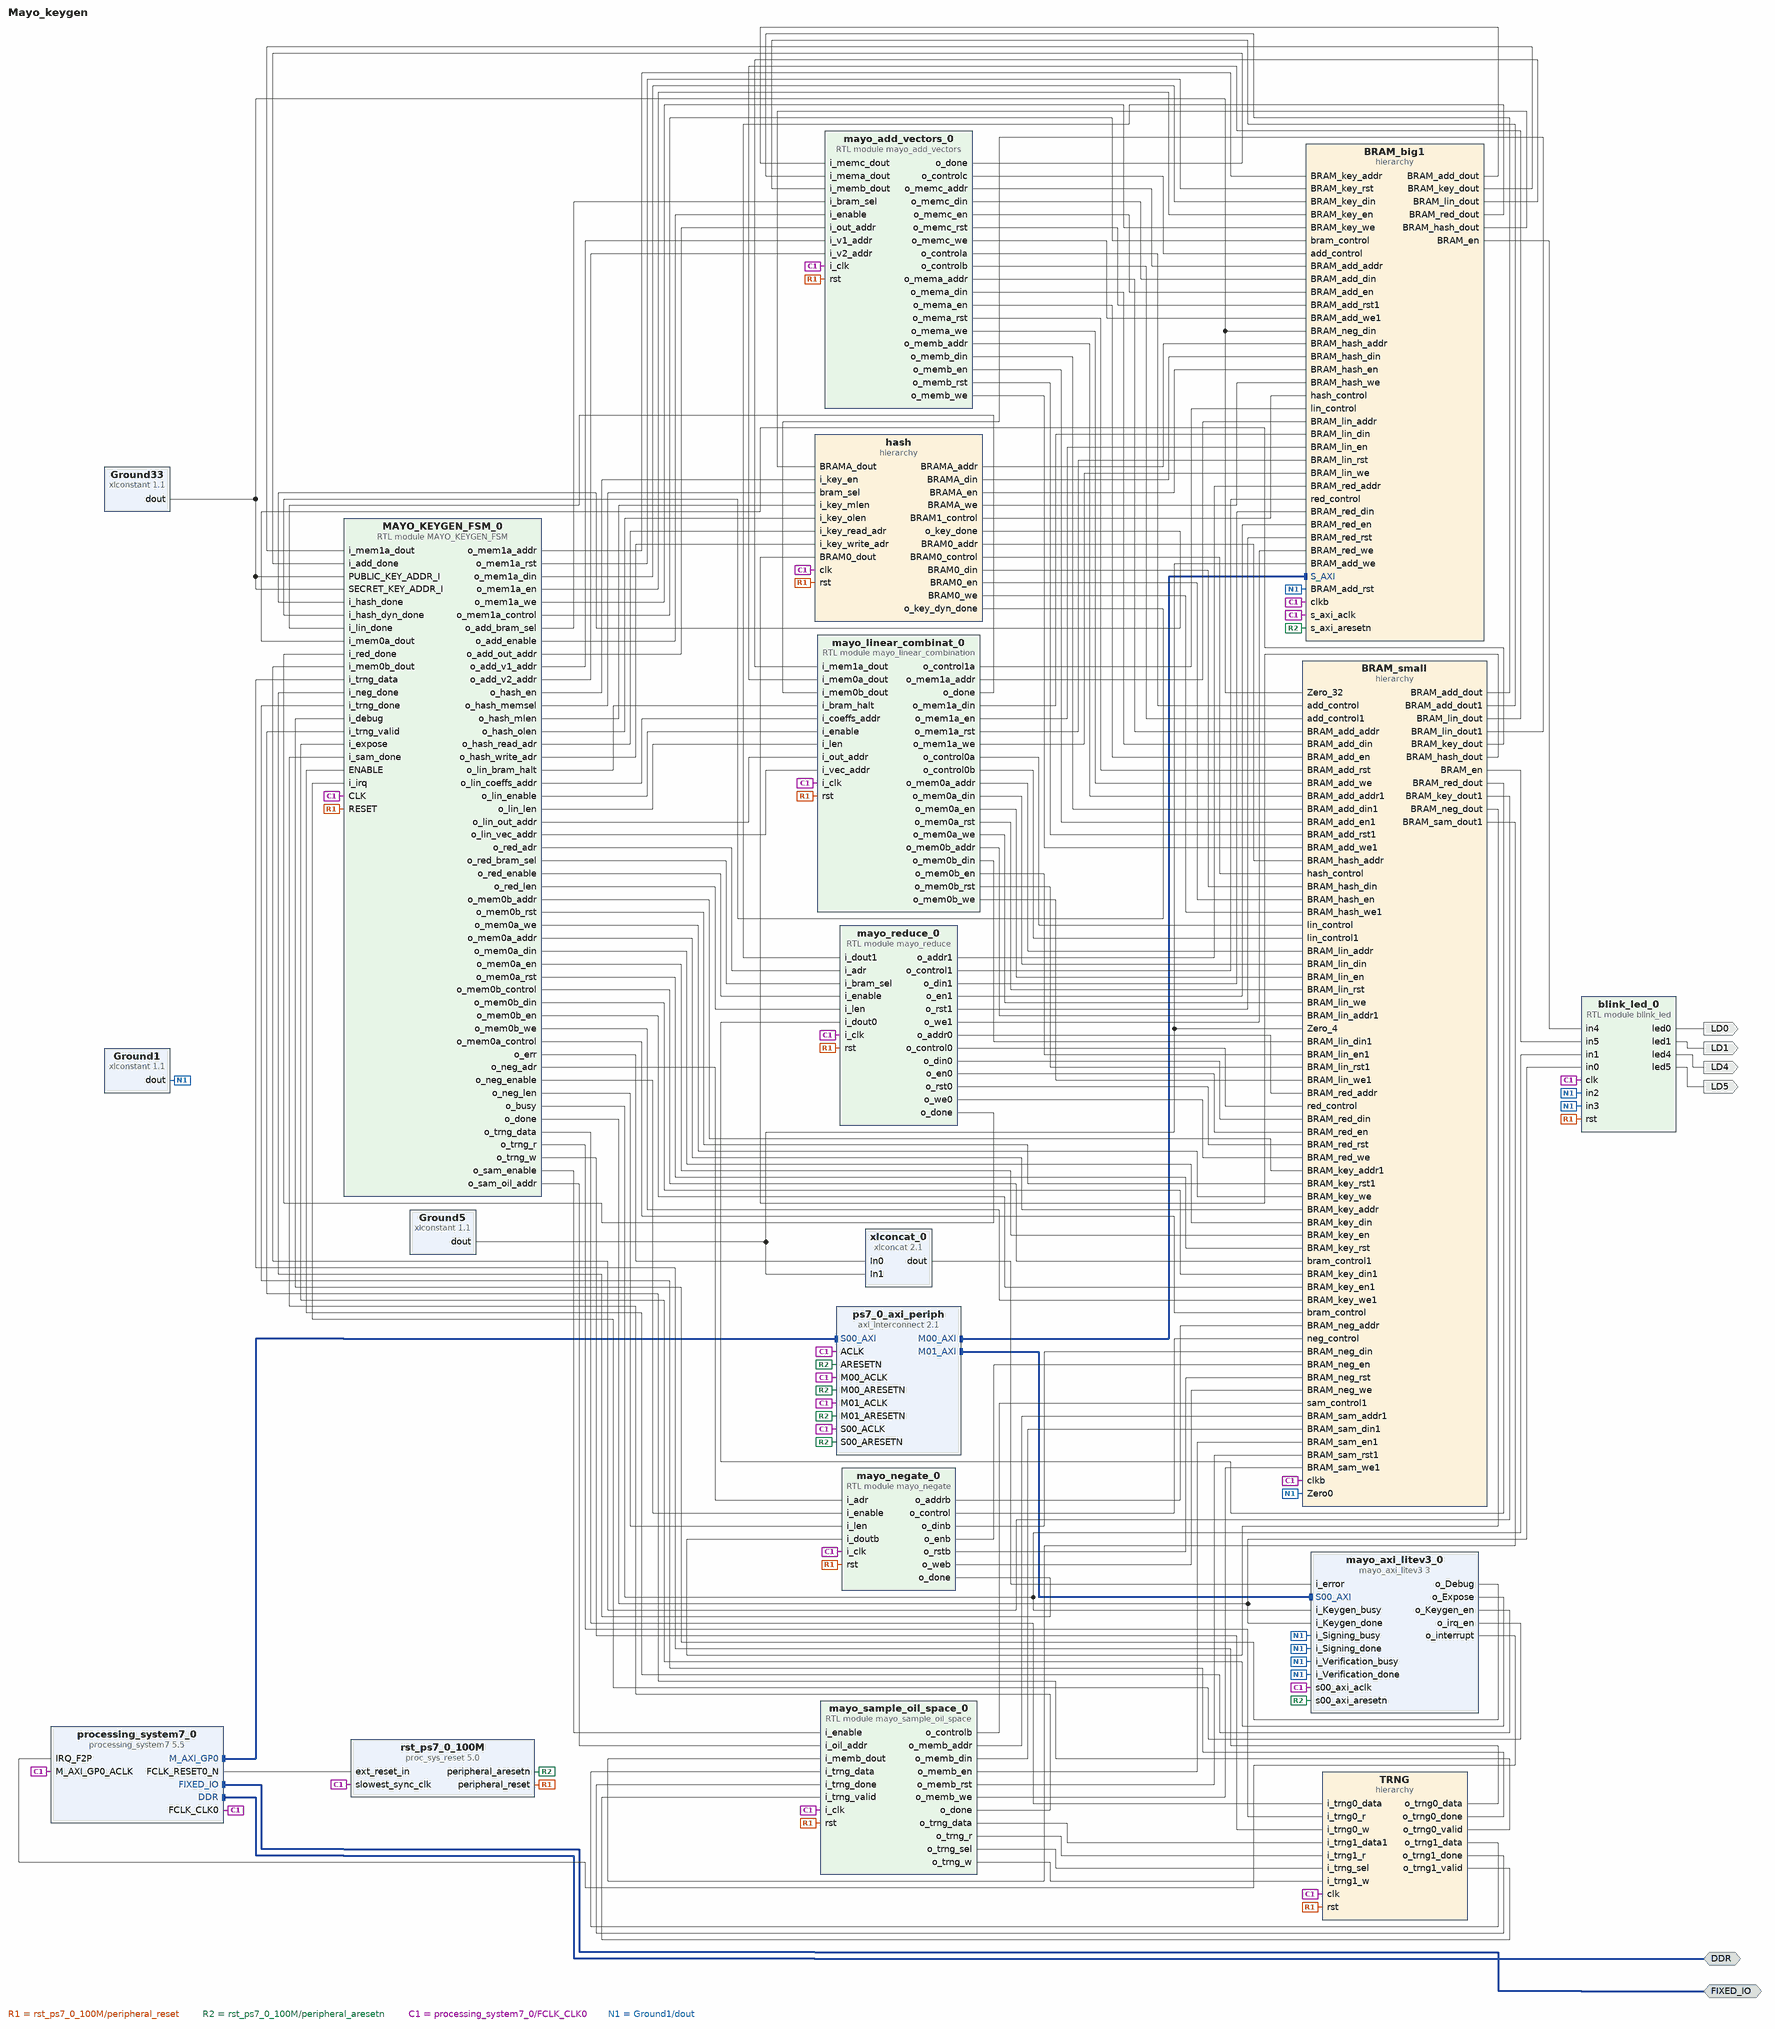
[diagram p0: block diagram of the top level]
# Vivado block design Mayo_keygen, xc7z020clg484-1, Vivado 2020.2
create_bd_design Mayo_keygen

create_bd_intf_port -mode Master -vlnv xilinx.com:interface:ddrx_rtl:1.0 DDR
create_bd_intf_port -mode Master -vlnv xilinx.com:display_processing_system7:fixedio_rtl:1.0 FIXED_IO
create_bd_port -dir O LD0
create_bd_port -dir O LD1
create_bd_port -dir O LD5
create_bd_port -dir O LD4

create_bd_cell -type ip -vlnv xilinx.com:ip:processing_system7:5.5 processing_system7_0
set_property -dict [list \
  CONFIG.PCW_APU_PERIPHERAL_FREQMHZ 666.666667 \
  CONFIG.PCW_ENET0_ENET0_IO {MIO 16 .. 27} \
  CONFIG.PCW_ENET0_GRP_MDIO_ENABLE 1 \
  CONFIG.PCW_ENET0_GRP_MDIO_IO {MIO 52 .. 53} \
  CONFIG.PCW_ENET0_PERIPHERAL_ENABLE 1 \
  CONFIG.PCW_ENET0_RESET_ENABLE 0 \
  CONFIG.PCW_ENET_RESET_ENABLE 1 \
  CONFIG.PCW_ENET_RESET_SELECT {Share reset pin} \
  CONFIG.PCW_FPGA0_PERIPHERAL_FREQMHZ 100 \
  CONFIG.PCW_FPGA1_PERIPHERAL_FREQMHZ 150.000000 \
  CONFIG.PCW_GPIO_MIO_GPIO_ENABLE 1 \
  CONFIG.PCW_GPIO_MIO_GPIO_IO MIO \
  CONFIG.PCW_I2C_RESET_ENABLE 1 \
  CONFIG.PCW_IRQ_F2P_INTR 1 \
  CONFIG.PCW_PRESET_BANK1_VOLTAGE {LVCMOS 1.8V} \
  CONFIG.PCW_QSPI_GRP_SINGLE_SS_ENABLE 1 \
  CONFIG.PCW_QSPI_GRP_SINGLE_SS_IO {MIO 1 .. 6} \
  CONFIG.PCW_QSPI_PERIPHERAL_ENABLE 1 \
  CONFIG.PCW_QSPI_QSPI_IO {MIO 1 .. 6} \
  CONFIG.PCW_SD0_GRP_CD_ENABLE 1 \
  CONFIG.PCW_SD0_GRP_CD_IO {MIO 47} \
  CONFIG.PCW_SD0_GRP_WP_ENABLE 1 \
  CONFIG.PCW_SD0_GRP_WP_IO {MIO 46} \
  CONFIG.PCW_SD0_PERIPHERAL_ENABLE 1 \
  CONFIG.PCW_SD0_SD0_IO {MIO 40 .. 45} \
  CONFIG.PCW_SDIO_PERIPHERAL_FREQMHZ 50 \
  CONFIG.PCW_SINGLE_QSPI_DATA_MODE x4 \
  CONFIG.PCW_TTC0_PERIPHERAL_ENABLE 1 \
  CONFIG.PCW_TTC0_TTC0_IO EMIO \
  CONFIG.PCW_UART1_PERIPHERAL_ENABLE 1 \
  CONFIG.PCW_UART1_UART1_IO {MIO 48 .. 49} \
  CONFIG.PCW_UART_PERIPHERAL_FREQMHZ 50 \
  CONFIG.PCW_UIPARAM_DDR_FREQ_MHZ 533.333313 \
  CONFIG.PCW_UIPARAM_DDR_PARTNO {MT41J128M16 HA-15E} \
  CONFIG.PCW_USB0_PERIPHERAL_ENABLE 1 \
  CONFIG.PCW_USB0_RESET_ENABLE 0 \
  CONFIG.PCW_USB0_USB0_IO {MIO 28 .. 39} \
  CONFIG.PCW_USB_RESET_ENABLE 1 \
  CONFIG.PCW_USB_RESET_SELECT {Share reset pin} \
  CONFIG.PCW_USE_FABRIC_INTERRUPT 1 \
  CONFIG.preset ZedBoard \
] [get_bd_cells processing_system7_0]
# 223 more settings of processing_system7_0 are not shown: defaults, MIO pin electricals, DDR timing, and values the tool derives
create_bd_cell -type ip -vlnv xilinx.com:ip:axi_interconnect:2.1 ps7_0_axi_periph
set_property -dict {CONFIG.NUM_MI 2} [get_bd_cells ps7_0_axi_periph]
create_bd_cell -type ip -vlnv xilinx.com:ip:proc_sys_reset:5.0 rst_ps7_0_100M
create_bd_cell -type hier BRAM_big1
create_bd_cell -type hier BRAM_small
create_bd_cell -type ip -vlnv xilinx.com:ip:xlconstant:1.1 Ground1
set_property -dict {CONFIG.CONST_VAL 0} [get_bd_cells Ground1]
create_bd_cell -type ip -vlnv xilinx.com:ip:xlconstant:1.1 Ground33
set_property -dict {CONFIG.CONST_VAL 0x00000000 CONFIG.CONST_WIDTH 32} [get_bd_cells Ground33]
create_bd_cell -type ip -vlnv xilinx.com:ip:xlconstant:1.1 Ground5
set_property -dict {CONFIG.CONST_VAL 0000 CONFIG.CONST_WIDTH 4} [get_bd_cells Ground5]
create_bd_cell -type hier TRNG
create_bd_cell -type hier hash
create_bd_cell -type ip -vlnv xilinx.com:ip:xlconcat:2.1 xlconcat_0
set_property -dict {CONFIG.NUM_PORTS 4} [get_bd_cells xlconcat_0]
create_bd_cell -type ip -vlnv user.org:user:mayo_axi_litev3:3 mayo_axi_litev3_0
create_bd_cell -type module -reference blink_led blink_led_0
create_bd_cell -type module -reference MAYO_KEYGEN_FSM MAYO_KEYGEN_FSM_0
create_bd_cell -type module -reference mayo_negate mayo_negate_0
set_property -dict {CONFIG.BRAM_SIZE 32} [get_bd_cells mayo_negate_0]
create_bd_cell -type module -reference mayo_reduce mayo_reduce_0
create_bd_cell -type module -reference mayo_sample_oil_space mayo_sample_oil_space_0
create_bd_cell -type module -reference mayo_linear_combination mayo_linear_combinat_0
create_bd_cell -type module -reference mayo_add_vectors mayo_add_vectors_0

# ---- hierarchy /BRAM_big1 ----
current_bd_instance /BRAM_big1
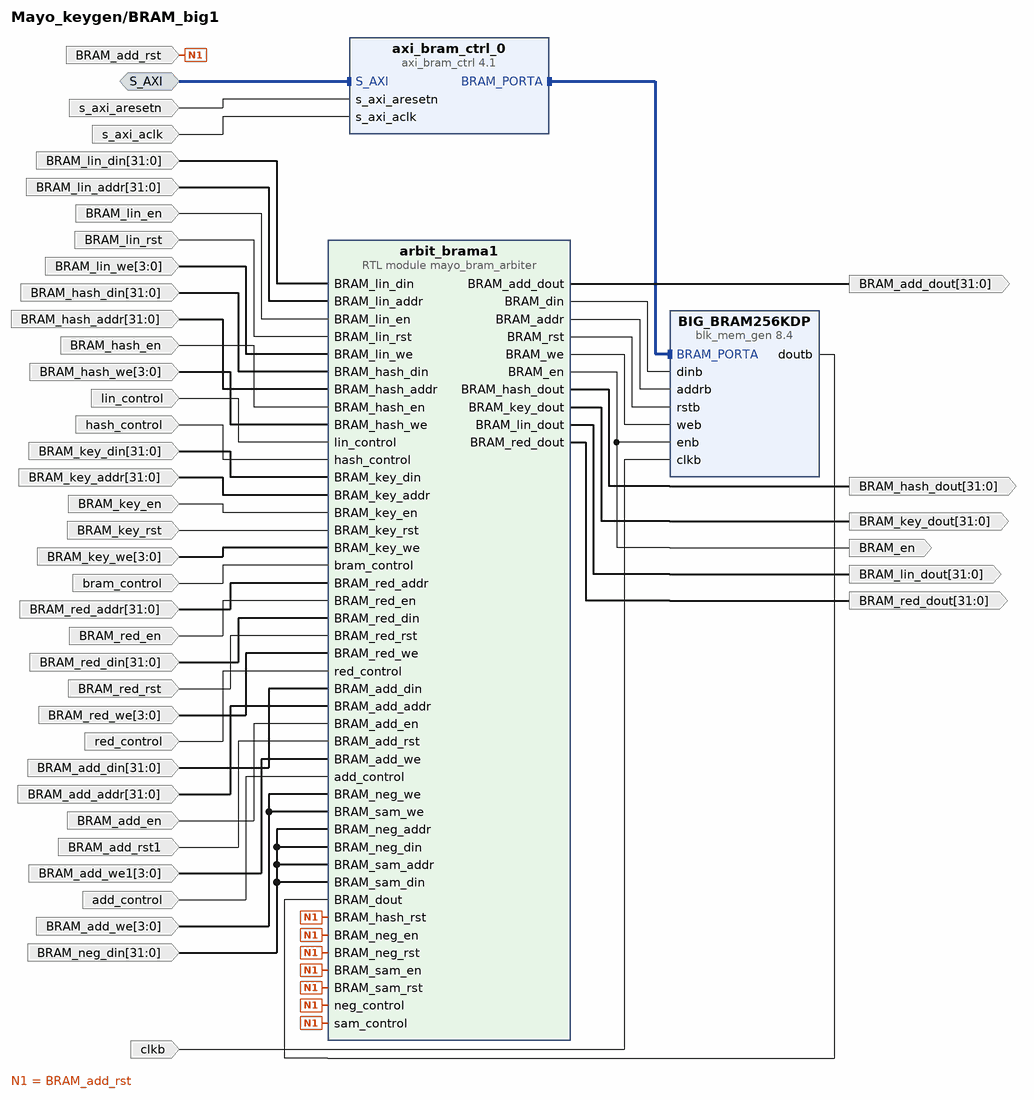
[diagram p1: block diagram inside /BRAM_big1]
create_bd_intf_pin -mode Slave -vlnv xilinx.com:interface:aximm_rtl:1.0 S_AXI
create_bd_pin -dir I -from 31 -to 0 BRAM_neg_din
create_bd_pin -dir I -type rst BRAM_add_rst
create_bd_pin -dir I -from 31 -to 0 BRAM_lin_din
create_bd_pin -dir I -from 31 -to 0 BRAM_lin_addr
create_bd_pin -dir I BRAM_lin_en
create_bd_pin -dir I -type rst BRAM_lin_rst
create_bd_pin -dir I -from 3 -to 0 BRAM_lin_we
create_bd_pin -dir O -from 31 -to 0 BRAM_lin_dout
create_bd_pin -dir O -from 31 -to 0 BRAM_key_dout
create_bd_pin -dir I -from 31 -to 0 BRAM_hash_din
create_bd_pin -dir I -from 31 -to 0 BRAM_hash_addr
create_bd_pin -dir I BRAM_hash_en
create_bd_pin -dir I -from 3 -to 0 BRAM_hash_we
create_bd_pin -dir O -from 31 -to 0 BRAM_hash_dout
create_bd_pin -dir I lin_control
create_bd_pin -dir I hash_control
create_bd_pin -dir I -from 31 -to 0 BRAM_key_din
create_bd_pin -dir I -from 31 -to 0 BRAM_key_addr
create_bd_pin -dir I BRAM_key_en
create_bd_pin -dir I -type rst BRAM_key_rst
create_bd_pin -dir I -from 3 -to 0 BRAM_key_we
create_bd_pin -dir I bram_control
create_bd_pin -dir I -from 3 -to 0 BRAM_add_we
create_bd_pin -dir I -from 31 -to 0 BRAM_red_addr
create_bd_pin -dir I BRAM_red_en
create_bd_pin -dir I -from 31 -to 0 BRAM_red_din
create_bd_pin -dir I -type rst BRAM_red_rst
create_bd_pin -dir I -from 3 -to 0 BRAM_red_we
create_bd_pin -dir I red_control
create_bd_pin -dir O -from 31 -to 0 BRAM_red_dout
create_bd_pin -dir O -from 31 -to 0 BRAM_add_dout
create_bd_pin -dir I -from 31 -to 0 BRAM_add_din
create_bd_pin -dir I -from 31 -to 0 BRAM_add_addr
create_bd_pin -dir I BRAM_add_en
create_bd_pin -dir I -type rst BRAM_add_rst1
create_bd_pin -dir I -from 3 -to 0 BRAM_add_we1
create_bd_pin -dir I add_control
create_bd_pin -dir I -type rst s_axi_aresetn
create_bd_pin -dir I -type clk s_axi_aclk
create_bd_pin -dir I -type clk clkb
create_bd_pin -dir O BRAM_en

create_bd_cell -type ip -vlnv xilinx.com:ip:axi_bram_ctrl:4.1 axi_bram_ctrl_0
set_property -dict {CONFIG.PROTOCOL AXI4 CONFIG.SINGLE_PORT_BRAM 1 CONFIG.USE_ECC 0} [get_bd_cells axi_bram_ctrl_0]
create_bd_cell -type ip -vlnv xilinx.com:ip:blk_mem_gen:8.4 BIG_BRAM256KDP
set_property -dict [list \
  CONFIG.EN_SAFETY_CKT true \
  CONFIG.Enable_32bit_Address true \
  CONFIG.Enable_B Use_ENB_Pin \
  CONFIG.Memory_Type True_Dual_Port_RAM \
  CONFIG.Port_B_Clock 100 \
  CONFIG.Port_B_Enable_Rate 100 \
  CONFIG.Port_B_Write_Rate 50 \
  CONFIG.Read_Width_A 32 \
  CONFIG.Read_Width_B 32 \
  CONFIG.Register_PortA_Output_of_Memory_Primitives false \
  CONFIG.Register_PortB_Output_of_Memory_Primitives false \
  CONFIG.Use_RSTA_Pin true \
  CONFIG.Use_RSTB_Pin true \
  CONFIG.Write_Width_A 32 \
  CONFIG.Write_Width_B 32 \
  CONFIG.use_bram_block BRAM_Controller \
] [get_bd_cells BIG_BRAM256KDP]
create_bd_cell -type module -reference mayo_bram_arbiter arbit_brama1

# ---- hierarchy /BRAM_small ----
current_bd_instance /BRAM_small
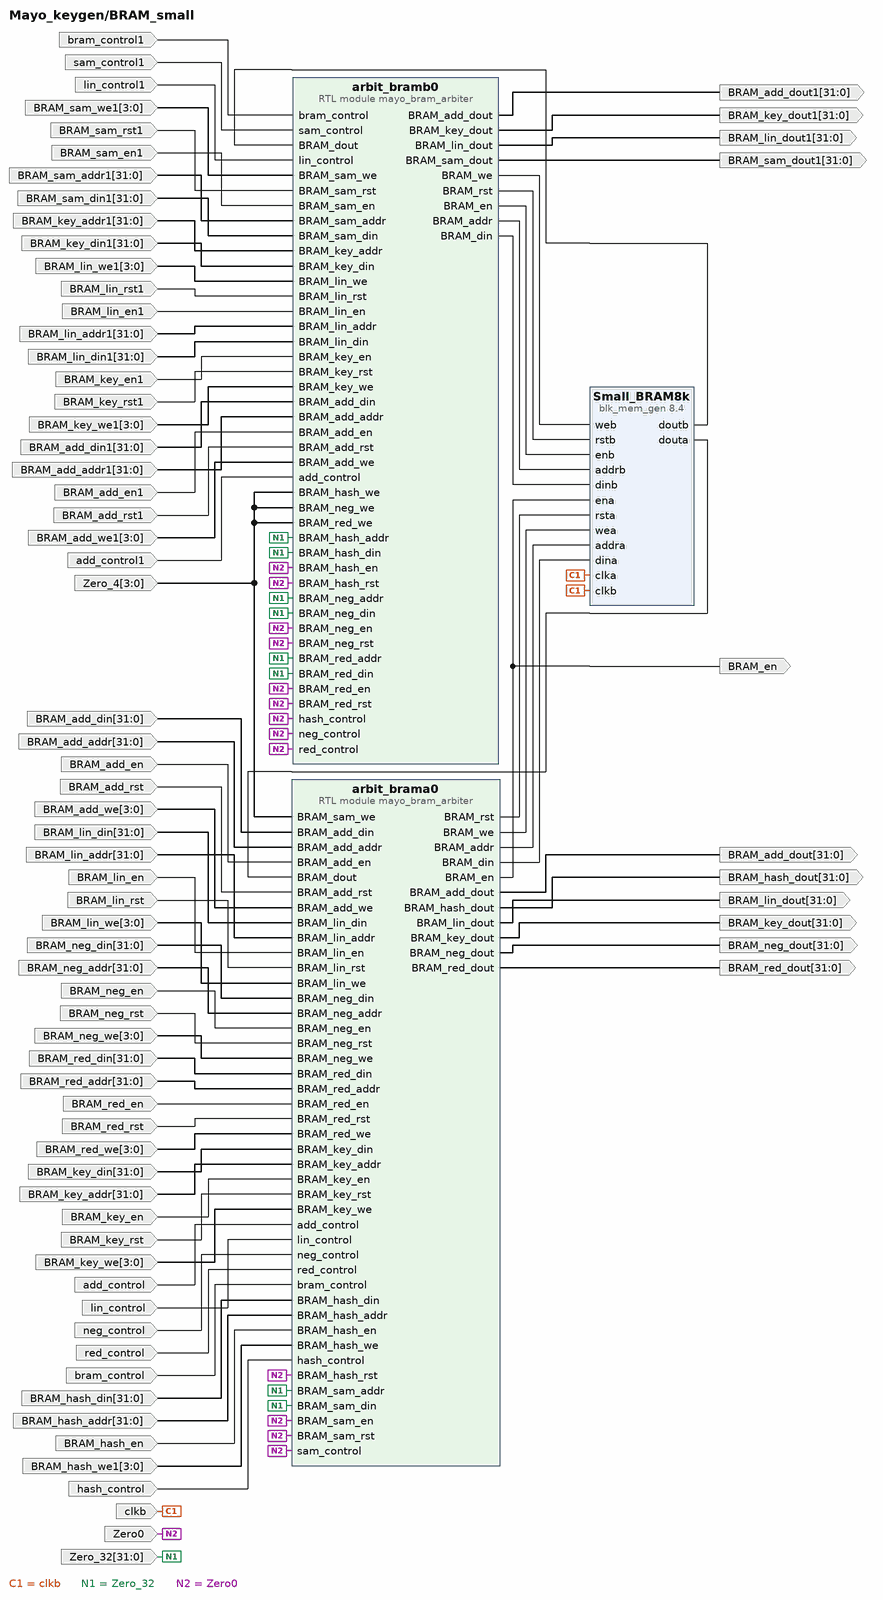
[diagram p2: block diagram inside /BRAM_small]
create_bd_pin -dir I -type clk clkb
create_bd_pin -dir I -from 31 -to 0 BRAM_add_din
create_bd_pin -dir I -from 31 -to 0 BRAM_add_addr
create_bd_pin -dir I BRAM_add_en
create_bd_pin -dir I -type rst BRAM_add_rst
create_bd_pin -dir I -from 3 -to 0 BRAM_add_we
create_bd_pin -dir O -from 31 -to 0 BRAM_add_dout
create_bd_pin -dir I -from 31 -to 0 BRAM_lin_din
create_bd_pin -dir I -from 31 -to 0 BRAM_lin_addr
create_bd_pin -dir I BRAM_lin_en
create_bd_pin -dir I -type rst BRAM_lin_rst
create_bd_pin -dir I -from 3 -to 0 BRAM_lin_we
create_bd_pin -dir O -from 31 -to 0 BRAM_lin_dout
create_bd_pin -dir I -from 31 -to 0 BRAM_neg_din
create_bd_pin -dir I -from 31 -to 0 BRAM_neg_addr
create_bd_pin -dir I BRAM_neg_en
create_bd_pin -dir I -type rst BRAM_neg_rst
create_bd_pin -dir I -from 3 -to 0 BRAM_neg_we
create_bd_pin -dir O -from 31 -to 0 BRAM_neg_dout
create_bd_pin -dir I -from 31 -to 0 BRAM_red_din
create_bd_pin -dir I -from 31 -to 0 BRAM_red_addr
create_bd_pin -dir I BRAM_red_en
create_bd_pin -dir I -type rst BRAM_red_rst
create_bd_pin -dir I -from 3 -to 0 BRAM_red_we
create_bd_pin -dir O -from 31 -to 0 BRAM_red_dout
create_bd_pin -dir I -from 31 -to 0 BRAM_key_din
create_bd_pin -dir I -from 31 -to 0 BRAM_key_addr
create_bd_pin -dir I BRAM_key_en
create_bd_pin -dir I -type rst BRAM_key_rst
create_bd_pin -dir I -from 3 -to 0 BRAM_key_we
create_bd_pin -dir O -from 31 -to 0 BRAM_key_dout
create_bd_pin -dir I -from 31 -to 0 Zero_32
create_bd_pin -dir I -type rst Zero0
create_bd_pin -dir I add_control
create_bd_pin -dir I lin_control
create_bd_pin -dir I neg_control
create_bd_pin -dir I red_control
create_bd_pin -dir I bram_control
create_bd_pin -dir I -from 3 -to 0 Zero_4
create_bd_pin -dir I bram_control1
create_bd_pin -dir I sam_control1
create_bd_pin -dir I lin_control1
create_bd_pin -dir O -from 31 -to 0 BRAM_sam_dout1
create_bd_pin -dir I -from 3 -to 0 BRAM_sam_we1
create_bd_pin -dir I -type rst BRAM_sam_rst1
create_bd_pin -dir I BRAM_sam_en1
create_bd_pin -dir I -from 31 -to 0 BRAM_sam_addr1
create_bd_pin -dir I -from 31 -to 0 BRAM_sam_din1
create_bd_pin -dir O -from 31 -to 0 BRAM_key_dout1
create_bd_pin -dir I -from 31 -to 0 BRAM_key_addr1
create_bd_pin -dir I -from 31 -to 0 BRAM_key_din1
create_bd_pin -dir O -from 31 -to 0 BRAM_lin_dout1
create_bd_pin -dir I -from 3 -to 0 BRAM_lin_we1
create_bd_pin -dir I -type rst BRAM_lin_rst1
create_bd_pin -dir I BRAM_lin_en1
create_bd_pin -dir I -from 31 -to 0 BRAM_lin_addr1
create_bd_pin -dir I -from 31 -to 0 BRAM_lin_din1
create_bd_pin -dir I BRAM_key_en1
create_bd_pin -dir I -type rst BRAM_key_rst1
create_bd_pin -dir I -from 3 -to 0 BRAM_key_we1
create_bd_pin -dir I -from 31 -to 0 BRAM_hash_din
create_bd_pin -dir I -from 31 -to 0 BRAM_hash_addr
create_bd_pin -dir I BRAM_hash_en
create_bd_pin -dir I -from 3 -to 0 BRAM_hash_we1
create_bd_pin -dir O -from 31 -to 0 BRAM_hash_dout
create_bd_pin -dir I hash_control
create_bd_pin -dir I -from 31 -to 0 BRAM_add_din1
create_bd_pin -dir I -from 31 -to 0 BRAM_add_addr1
create_bd_pin -dir I BRAM_add_en1
create_bd_pin -dir I -type rst BRAM_add_rst1
create_bd_pin -dir I -from 3 -to 0 BRAM_add_we1
create_bd_pin -dir O -from 31 -to 0 BRAM_add_dout1
create_bd_pin -dir I add_control1
create_bd_pin -dir O BRAM_en

create_bd_cell -type ip -vlnv xilinx.com:ip:blk_mem_gen:8.4 Small_BRAM8k
set_property -dict [list \
  CONFIG.EN_SAFETY_CKT true \
  CONFIG.Enable_32bit_Address true \
  CONFIG.Enable_B Use_ENB_Pin \
  CONFIG.Memory_Type True_Dual_Port_RAM \
  CONFIG.Port_B_Clock 100 \
  CONFIG.Port_B_Enable_Rate 100 \
  CONFIG.Port_B_Write_Rate 50 \
  CONFIG.Read_Width_A 32 \
  CONFIG.Read_Width_B 32 \
  CONFIG.Register_PortA_Output_of_Memory_Primitives false \
  CONFIG.Register_PortB_Output_of_Memory_Primitives false \
  CONFIG.Use_RSTA_Pin true \
  CONFIG.Use_RSTB_Pin true \
  CONFIG.Write_Width_A 32 \
  CONFIG.Write_Width_B 32 \
  CONFIG.use_bram_block Stand_Alone \
] [get_bd_cells Small_BRAM8k]
create_bd_cell -type module -reference mayo_bram_arbiter arbit_brama0
create_bd_cell -type module -reference mayo_bram_arbiter arbit_bramb0

# ---- hierarchy /TRNG ----
current_bd_instance /TRNG
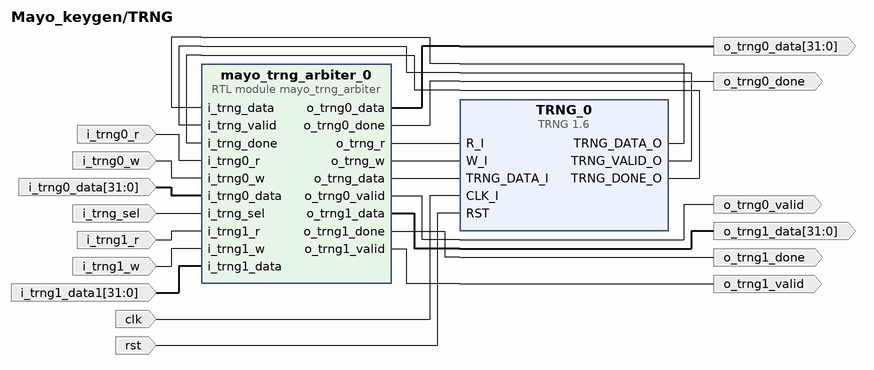
[diagram p3: block diagram inside /TRNG]
create_bd_pin -dir I clk
create_bd_pin -dir I rst
create_bd_pin -dir O -from 31 -to 0 o_trng0_data
create_bd_pin -dir O o_trng0_valid
create_bd_pin -dir O o_trng0_done
create_bd_pin -dir I i_trng0_r
create_bd_pin -dir I i_trng0_w
create_bd_pin -dir I -from 31 -to 0 i_trng0_data
create_bd_pin -dir O -from 31 -to 0 o_trng1_data
create_bd_pin -dir O o_trng1_valid
create_bd_pin -dir O o_trng1_done
create_bd_pin -dir I i_trng_sel
create_bd_pin -dir I i_trng1_r
create_bd_pin -dir I i_trng1_w
create_bd_pin -dir I -from 31 -to 0 i_trng1_data1

create_bd_cell -type ip -vlnv user.org:user:TRNG:1.6 TRNG_0
set_property -dict {CONFIG.IS_SIM true} [get_bd_cells TRNG_0]
create_bd_cell -type module -reference mayo_trng_arbiter mayo_trng_arbiter_0

# ---- hierarchy /hash ----
current_bd_instance /hash
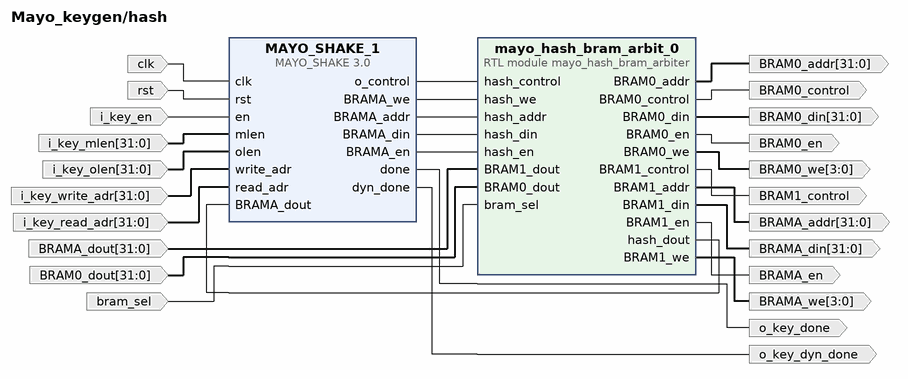
[diagram p4: block diagram inside /hash]
create_bd_pin -dir I -type clk clk
create_bd_pin -dir I -type rst rst
create_bd_pin -dir I i_key_en
create_bd_pin -dir I -from 31 -to 0 i_key_mlen
create_bd_pin -dir I -from 31 -to 0 i_key_olen
create_bd_pin -dir I -from 31 -to 0 i_key_write_adr
create_bd_pin -dir I -from 31 -to 0 i_key_read_adr
create_bd_pin -dir O o_key_done
create_bd_pin -dir O o_key_dyn_done
create_bd_pin -dir O -from 3 -to 0 BRAMA_we
create_bd_pin -dir O -from 31 -to 0 BRAMA_addr
create_bd_pin -dir O -from 31 -to 0 BRAMA_din
create_bd_pin -dir O BRAMA_en
create_bd_pin -dir I -from 31 -to 0 BRAMA_dout
create_bd_pin -dir O -from 31 -to 0 BRAM0_din
create_bd_pin -dir O -from 31 -to 0 BRAM0_addr
create_bd_pin -dir O BRAM0_en
create_bd_pin -dir O -from 3 -to 0 BRAM0_we
create_bd_pin -dir I -from 31 -to 0 BRAM0_dout
create_bd_pin -dir O BRAM1_control
create_bd_pin -dir O BRAM0_control
create_bd_pin -dir I bram_sel

create_bd_cell -type ip -vlnv user.org:user:MAYO_SHAKE:3.0 MAYO_SHAKE_1
create_bd_cell -type module -reference mayo_hash_bram_arbiter mayo_hash_bram_arbit_0

# ---- connections ----

current_bd_instance /BRAM_big1
connect_bd_intf_net [get_bd_intf_pins S_AXI] [get_bd_intf_pins axi_bram_ctrl_0/S_AXI]
connect_bd_intf_net [get_bd_intf_pins axi_bram_ctrl_0/BRAM_PORTA] [get_bd_intf_pins BIG_BRAM256KDP/BRAM_PORTA]
connect_bd_net -net mayo_linear_combinat_0_o_mem1a_din [get_bd_pins BRAM_lin_din] [get_bd_pins arbit_brama1/BRAM_lin_din]
connect_bd_net -net mayo_linear_combinat_0_o_mem1a_addr [get_bd_pins BRAM_lin_addr] [get_bd_pins arbit_brama1/BRAM_lin_addr]
connect_bd_net -net mayo_linear_combinat_0_o_mem1a_en [get_bd_pins BRAM_lin_en] [get_bd_pins arbit_brama1/BRAM_lin_en]
connect_bd_net -net mayo_linear_combinat_0_o_mem1a_rst [get_bd_pins BRAM_lin_rst] [get_bd_pins arbit_brama1/BRAM_lin_rst]
connect_bd_net -net mayo_linear_combinat_0_o_mem1a_we [get_bd_pins BRAM_lin_we] [get_bd_pins arbit_brama1/BRAM_lin_we]
connect_bd_net [get_bd_pins arbit_brama1/BRAM_lin_dout] [get_bd_pins BRAM_lin_dout]
connect_bd_net [get_bd_pins arbit_brama1/BRAM_key_dout] [get_bd_pins BRAM_key_dout]
connect_bd_net -net MAYO_SHAKE_1_BRAMA_din [get_bd_pins BRAM_hash_din] [get_bd_pins arbit_brama1/BRAM_hash_din]
connect_bd_net -net MAYO_SHAKE_1_BRAMA_addr [get_bd_pins BRAM_hash_addr] [get_bd_pins arbit_brama1/BRAM_hash_addr]
connect_bd_net -net MAYO_SHAKE_1_BRAMA_en [get_bd_pins BRAM_hash_en] [get_bd_pins arbit_brama1/BRAM_hash_en]
connect_bd_net -net MAYO_SHAKE_1_BRAMA_we [get_bd_pins BRAM_hash_we] [get_bd_pins arbit_brama1/BRAM_hash_we]
connect_bd_net [get_bd_pins arbit_brama1/BRAM_hash_dout] [get_bd_pins BRAM_hash_dout]
connect_bd_net -net mayo_linear_combinat_0_o_control1a [get_bd_pins lin_control] [get_bd_pins arbit_brama1/lin_control]
connect_bd_net -net MAYO_SHAKE_1_o_control [get_bd_pins hash_control] [get_bd_pins arbit_brama1/hash_control]
connect_bd_net [get_bd_pins BRAM_key_din] [get_bd_pins arbit_brama1/BRAM_key_din]
connect_bd_net [get_bd_pins BRAM_key_addr] [get_bd_pins arbit_brama1/BRAM_key_addr]
connect_bd_net [get_bd_pins BRAM_key_en] [get_bd_pins arbit_brama1/BRAM_key_en]
connect_bd_net [get_bd_pins BRAM_key_rst] [get_bd_pins arbit_brama1/BRAM_key_rst]
connect_bd_net [get_bd_pins BRAM_key_we] [get_bd_pins arbit_brama1/BRAM_key_we]
connect_bd_net [get_bd_pins bram_control] [get_bd_pins arbit_brama1/bram_control]
connect_bd_net [get_bd_pins BRAM_red_addr] [get_bd_pins arbit_brama1/BRAM_red_addr]
connect_bd_net [get_bd_pins BRAM_red_en] [get_bd_pins arbit_brama1/BRAM_red_en]
connect_bd_net [get_bd_pins BRAM_red_din] [get_bd_pins arbit_brama1/BRAM_red_din]
connect_bd_net [get_bd_pins BRAM_red_rst] [get_bd_pins arbit_brama1/BRAM_red_rst]
connect_bd_net [get_bd_pins BRAM_red_we] [get_bd_pins arbit_brama1/BRAM_red_we]
connect_bd_net [get_bd_pins red_control] [get_bd_pins arbit_brama1/red_control]
connect_bd_net [get_bd_pins arbit_brama1/BRAM_red_dout] [get_bd_pins BRAM_red_dout]
connect_bd_net [get_bd_pins arbit_brama1/BRAM_add_dout] [get_bd_pins BRAM_add_dout]
connect_bd_net [get_bd_pins BRAM_add_din] [get_bd_pins arbit_brama1/BRAM_add_din]
connect_bd_net [get_bd_pins BRAM_add_addr] [get_bd_pins arbit_brama1/BRAM_add_addr]
connect_bd_net [get_bd_pins BRAM_add_en] [get_bd_pins arbit_brama1/BRAM_add_en]
connect_bd_net -net BRAM_add_rst1_1 [get_bd_pins BRAM_add_rst1] [get_bd_pins arbit_brama1/BRAM_add_rst]
connect_bd_net -net BRAM_add_we1_1 [get_bd_pins BRAM_add_we1] [get_bd_pins arbit_brama1/BRAM_add_we]
connect_bd_net [get_bd_pins add_control] [get_bd_pins arbit_brama1/add_control]
connect_bd_net [get_bd_pins BRAM_add_rst] \
  [get_bd_pins arbit_brama1/BRAM_neg_en] [get_bd_pins arbit_brama1/BRAM_neg_rst] [get_bd_pins arbit_brama1/BRAM_sam_en] \
  [get_bd_pins arbit_brama1/BRAM_sam_rst] [get_bd_pins arbit_brama1/BRAM_hash_rst] [get_bd_pins arbit_brama1/neg_control] \
  [get_bd_pins arbit_brama1/sam_control]
connect_bd_net [get_bd_pins BRAM_add_we] [get_bd_pins arbit_brama1/BRAM_neg_we] [get_bd_pins arbit_brama1/BRAM_sam_we]
connect_bd_net [get_bd_pins s_axi_aresetn] [get_bd_pins axi_bram_ctrl_0/s_axi_aresetn]
connect_bd_net [get_bd_pins s_axi_aclk] [get_bd_pins axi_bram_ctrl_0/s_axi_aclk]
connect_bd_net [get_bd_pins BRAM_neg_din] \
  [get_bd_pins arbit_brama1/BRAM_neg_din] [get_bd_pins arbit_brama1/BRAM_neg_addr] [get_bd_pins arbit_brama1/BRAM_sam_din] \
  [get_bd_pins arbit_brama1/BRAM_sam_addr]
connect_bd_net [get_bd_pins BIG_BRAM256KDP/doutb] [get_bd_pins arbit_brama1/BRAM_dout]
connect_bd_net [get_bd_pins arbit_brama1/BRAM_din] [get_bd_pins BIG_BRAM256KDP/dinb]
connect_bd_net [get_bd_pins arbit_brama1/BRAM_addr] [get_bd_pins BIG_BRAM256KDP/addrb]
connect_bd_net -net clka_1 [get_bd_pins clkb] [get_bd_pins BIG_BRAM256KDP/clkb]
connect_bd_net [get_bd_pins arbit_brama1/BRAM_en] [get_bd_pins BIG_BRAM256KDP/enb] [get_bd_pins BRAM_en]
connect_bd_net [get_bd_pins arbit_brama1/BRAM_rst] [get_bd_pins BIG_BRAM256KDP/rstb]
connect_bd_net [get_bd_pins arbit_brama1/BRAM_we] [get_bd_pins BIG_BRAM256KDP/web]
set_property HDL_ATTRIBUTE.BMM_INFO_ADDRESS_SPACE {byte  0x40000000 32 > Mayo_keygen BRAM_big1/BIG_BRAM256KDP} [get_bd_cells axi_bram_ctrl_0]
set_property HDL_ATTRIBUTE.KEEP_HIERARCHY yes [get_bd_cells axi_bram_ctrl_0]

current_bd_instance /BRAM_small
connect_bd_net [get_bd_pins arbit_brama0/BRAM_rst] [get_bd_pins Small_BRAM8k/rsta]
connect_bd_net [get_bd_pins arbit_brama0/BRAM_en] [get_bd_pins Small_BRAM8k/ena] [get_bd_pins BRAM_en]
connect_bd_net [get_bd_pins arbit_brama0/BRAM_we] [get_bd_pins Small_BRAM8k/wea]
connect_bd_net [get_bd_pins arbit_brama0/BRAM_addr] [get_bd_pins Small_BRAM8k/addra]
connect_bd_net [get_bd_pins arbit_brama0/BRAM_din] [get_bd_pins Small_BRAM8k/dina]
connect_bd_net [get_bd_pins Small_BRAM8k/douta] [get_bd_pins arbit_brama0/BRAM_dout]
connect_bd_net -net processing_system7_0_FCLK_CLK0 [get_bd_pins clkb] [get_bd_pins Small_BRAM8k/clkb] [get_bd_pins Small_BRAM8k/clka]
connect_bd_net -net mayo_add_vectors_0_o_mema_din [get_bd_pins BRAM_add_din] [get_bd_pins arbit_brama0/BRAM_add_din]
connect_bd_net -net mayo_add_vectors_0_o_mema_addr [get_bd_pins BRAM_add_addr] [get_bd_pins arbit_brama0/BRAM_add_addr]
connect_bd_net -net mayo_add_vectors_0_o_mema_en [get_bd_pins BRAM_add_en] [get_bd_pins arbit_brama0/BRAM_add_en]
connect_bd_net -net mayo_add_vectors_0_o_mema_rst [get_bd_pins BRAM_add_rst] [get_bd_pins arbit_brama0/BRAM_add_rst]
connect_bd_net -net mayo_add_vectors_0_o_mema_we [get_bd_pins BRAM_add_we] [get_bd_pins arbit_brama0/BRAM_add_we]
connect_bd_net [get_bd_pins arbit_brama0/BRAM_add_dout] [get_bd_pins BRAM_add_dout]
connect_bd_net -net mayo_linear_combinat_0_o_mem0a_din [get_bd_pins BRAM_lin_din] [get_bd_pins arbit_brama0/BRAM_lin_din]
connect_bd_net -net mayo_linear_combinat_0_o_mem0a_addr [get_bd_pins BRAM_lin_addr] [get_bd_pins arbit_brama0/BRAM_lin_addr]
connect_bd_net -net mayo_linear_combinat_0_o_mem0a_en [get_bd_pins BRAM_lin_en] [get_bd_pins arbit_brama0/BRAM_lin_en]
connect_bd_net -net mayo_linear_combinat_0_o_mem0a_rst [get_bd_pins BRAM_lin_rst] [get_bd_pins arbit_brama0/BRAM_lin_rst]
connect_bd_net -net mayo_linear_combinat_0_o_mem0a_we [get_bd_pins BRAM_lin_we] [get_bd_pins arbit_brama0/BRAM_lin_we]
connect_bd_net [get_bd_pins arbit_brama0/BRAM_lin_dout] [get_bd_pins BRAM_lin_dout]
connect_bd_net -net mayo_negate_0_o_dinb [get_bd_pins BRAM_neg_din] [get_bd_pins arbit_brama0/BRAM_neg_din]
connect_bd_net -net mayo_negate_0_o_addrb [get_bd_pins BRAM_neg_addr] [get_bd_pins arbit_brama0/BRAM_neg_addr]
connect_bd_net -net mayo_negate_0_o_enb [get_bd_pins BRAM_neg_en] [get_bd_pins arbit_brama0/BRAM_neg_en]
connect_bd_net -net mayo_negate_0_o_rstb [get_bd_pins BRAM_neg_rst] [get_bd_pins arbit_brama0/BRAM_neg_rst]
connect_bd_net -net mayo_negate_0_o_web [get_bd_pins BRAM_neg_we] [get_bd_pins arbit_brama0/BRAM_neg_we]
connect_bd_net [get_bd_pins arbit_brama0/BRAM_neg_dout] [get_bd_pins BRAM_neg_dout]
connect_bd_net -net mayo_reduce_0_o_dinb [get_bd_pins BRAM_red_din] [get_bd_pins arbit_brama0/BRAM_red_din]
connect_bd_net -net mayo_reduce_0_o_addrb [get_bd_pins BRAM_red_addr] [get_bd_pins arbit_brama0/BRAM_red_addr]
connect_bd_net -net mayo_reduce_0_o_enb [get_bd_pins BRAM_red_en] [get_bd_pins arbit_brama0/BRAM_red_en]
connect_bd_net -net mayo_reduce_0_o_rstb [get_bd_pins BRAM_red_rst] [get_bd_pins arbit_brama0/BRAM_red_rst]
connect_bd_net -net mayo_reduce_0_o_web [get_bd_pins BRAM_red_we] [get_bd_pins arbit_brama0/BRAM_red_we]
connect_bd_net [get_bd_pins arbit_brama0/BRAM_red_dout] [get_bd_pins BRAM_red_dout]
connect_bd_net -net AXI_LITE_Mayo_Keygen_0_o_mem0a_din [get_bd_pins BRAM_key_din] [get_bd_pins arbit_brama0/BRAM_key_din]
connect_bd_net -net AXI_LITE_Mayo_Keygen_0_o_mem0a_addr [get_bd_pins BRAM_key_addr] [get_bd_pins arbit_brama0/BRAM_key_addr]
connect_bd_net -net AXI_LITE_Mayo_Keygen_0_o_mem0a_en [get_bd_pins BRAM_key_en] [get_bd_pins arbit_brama0/BRAM_key_en]
connect_bd_net -net AXI_LITE_Mayo_Keygen_0_o_mem0a_rst [get_bd_pins BRAM_key_rst] [get_bd_pins arbit_brama0/BRAM_key_rst]
connect_bd_net -net AXI_LITE_Mayo_Keygen_0_o_mem0a_we [get_bd_pins BRAM_key_we] [get_bd_pins arbit_brama0/BRAM_key_we]
connect_bd_net [get_bd_pins arbit_brama0/BRAM_key_dout] [get_bd_pins BRAM_key_dout]
connect_bd_net -net mayo_add_vectors_0_o_controla [get_bd_pins add_control] [get_bd_pins arbit_brama0/add_control]
connect_bd_net -net mayo_linear_combinat_0_o_control0a [get_bd_pins lin_control] [get_bd_pins arbit_brama0/lin_control]
connect_bd_net -net mayo_negate_0_o_control [get_bd_pins neg_control] [get_bd_pins arbit_brama0/neg_control]
connect_bd_net -net mayo_reduce_0_o_control [get_bd_pins red_control] [get_bd_pins arbit_brama0/red_control]
connect_bd_net -net AXI_LITE_Mayo_Keygen_0_o_mem0a_control [get_bd_pins bram_control] [get_bd_pins arbit_brama0/bram_control]
connect_bd_net -net bram_control1_1 [get_bd_pins bram_control1] [get_bd_pins arbit_bramb0/bram_control]
connect_bd_net -net sam_control1_1 [get_bd_pins sam_control1] [get_bd_pins arbit_bramb0/sam_control]
connect_bd_net -net mayo_linear_combinat_0_o_control0b [get_bd_pins lin_control1] [get_bd_pins arbit_bramb0/lin_control]
connect_bd_net [get_bd_pins Small_BRAM8k/doutb] [get_bd_pins arbit_bramb0/BRAM_dout]
connect_bd_net [get_bd_pins arbit_bramb0/BRAM_we] [get_bd_pins Small_BRAM8k/web]
connect_bd_net [get_bd_pins arbit_bramb0/BRAM_rst] [get_bd_pins Small_BRAM8k/rstb]
connect_bd_net [get_bd_pins arbit_bramb0/BRAM_en] [get_bd_pins Small_BRAM8k/enb]
connect_bd_net [get_bd_pins arbit_bramb0/BRAM_addr] [get_bd_pins Small_BRAM8k/addrb]
connect_bd_net [get_bd_pins arbit_bramb0/BRAM_din] [get_bd_pins Small_BRAM8k/dinb]
connect_bd_net [get_bd_pins arbit_bramb0/BRAM_sam_dout] [get_bd_pins BRAM_sam_dout1]
connect_bd_net -net mayo_sample_oil_space_0_o_memb_we [get_bd_pins BRAM_sam_we1] [get_bd_pins arbit_bramb0/BRAM_sam_we]
connect_bd_net -net mayo_sample_oil_space_0_o_memb_rst [get_bd_pins BRAM_sam_rst1] [get_bd_pins arbit_bramb0/BRAM_sam_rst]
connect_bd_net -net mayo_sample_oil_space_0_o_memb_en [get_bd_pins BRAM_sam_en1] [get_bd_pins arbit_bramb0/BRAM_sam_en]
connect_bd_net -net mayo_sample_oil_space_0_o_memb_addr [get_bd_pins BRAM_sam_addr1] [get_bd_pins arbit_bramb0/BRAM_sam_addr]
connect_bd_net -net mayo_sample_oil_space_0_o_memb_din [get_bd_pins BRAM_sam_din1] [get_bd_pins arbit_bramb0/BRAM_sam_din]
connect_bd_net [get_bd_pins arbit_bramb0/BRAM_key_dout] [get_bd_pins BRAM_key_dout1]
connect_bd_net -net BRAM_key_addr1_1 [get_bd_pins BRAM_key_addr1] [get_bd_pins arbit_bramb0/BRAM_key_addr]
connect_bd_net -net BRAM_key_din1_1 [get_bd_pins BRAM_key_din1] [get_bd_pins arbit_bramb0/BRAM_key_din]
connect_bd_net -net mayo_bram_arbiter_1_BRAM_lin_dout [get_bd_pins arbit_bramb0/BRAM_lin_dout] [get_bd_pins BRAM_lin_dout1]
connect_bd_net -net mayo_linear_combinat_0_o_mem0b_we [get_bd_pins BRAM_lin_we1] [get_bd_pins arbit_bramb0/BRAM_lin_we]
connect_bd_net -net mayo_linear_combinat_0_o_mem0b_rst [get_bd_pins BRAM_lin_rst1] [get_bd_pins arbit_bramb0/BRAM_lin_rst]
connect_bd_net -net mayo_linear_combinat_0_o_mem0b_en [get_bd_pins BRAM_lin_en1] [get_bd_pins arbit_bramb0/BRAM_lin_en]
connect_bd_net -net mayo_linear_combinat_0_o_mem0b_addr [get_bd_pins BRAM_lin_addr1] [get_bd_pins arbit_bramb0/BRAM_lin_addr]
connect_bd_net -net mayo_linear_combinat_0_o_mem0b_din [get_bd_pins BRAM_lin_din1] [get_bd_pins arbit_bramb0/BRAM_lin_din]
connect_bd_net -net BRAM_key_en1_1 [get_bd_pins BRAM_key_en1] [get_bd_pins arbit_bramb0/BRAM_key_en]
connect_bd_net -net BRAM_key_rst1_1 [get_bd_pins BRAM_key_rst1] [get_bd_pins arbit_bramb0/BRAM_key_rst]
connect_bd_net -net BRAM_key_we1_1 [get_bd_pins BRAM_key_we1] [get_bd_pins arbit_bramb0/BRAM_key_we]
connect_bd_net [get_bd_pins BRAM_hash_din] [get_bd_pins arbit_brama0/BRAM_hash_din]
connect_bd_net [get_bd_pins BRAM_hash_addr] [get_bd_pins arbit_brama0/BRAM_hash_addr]
connect_bd_net [get_bd_pins BRAM_hash_en] [get_bd_pins arbit_brama0/BRAM_hash_en]
connect_bd_net -net BRAM_hash_we1_1 [get_bd_pins BRAM_hash_we1] [get_bd_pins arbit_brama0/BRAM_hash_we]
connect_bd_net [get_bd_pins arbit_brama0/BRAM_hash_dout] [get_bd_pins BRAM_hash_dout]
connect_bd_net [get_bd_pins hash_control] [get_bd_pins arbit_brama0/hash_control]
connect_bd_net -net BRAM_add_din1_1 [get_bd_pins BRAM_add_din1] [get_bd_pins arbit_bramb0/BRAM_add_din]
connect_bd_net -net BRAM_add_addr1_1 [get_bd_pins BRAM_add_addr1] [get_bd_pins arbit_bramb0/BRAM_add_addr]
connect_bd_net -net BRAM_add_en1_1 [get_bd_pins BRAM_add_en1] [get_bd_pins arbit_bramb0/BRAM_add_en]
connect_bd_net -net BRAM_add_rst1_1 [get_bd_pins BRAM_add_rst1] [get_bd_pins arbit_bramb0/BRAM_add_rst]
connect_bd_net -net BRAM_add_we1_1 [get_bd_pins BRAM_add_we1] [get_bd_pins arbit_bramb0/BRAM_add_we]
connect_bd_net [get_bd_pins arbit_bramb0/BRAM_add_dout] [get_bd_pins BRAM_add_dout1]
connect_bd_net -net Zero_4_1 [get_bd_pins Zero_4] \
  [get_bd_pins arbit_brama0/BRAM_sam_we] [get_bd_pins arbit_bramb0/BRAM_neg_we] [get_bd_pins arbit_bramb0/BRAM_red_we] \
  [get_bd_pins arbit_bramb0/BRAM_hash_we]
connect_bd_net -net Zero_32_1 [get_bd_pins Zero_32] \
  [get_bd_pins arbit_brama0/BRAM_sam_din] [get_bd_pins arbit_brama0/BRAM_sam_addr] [get_bd_pins arbit_bramb0/BRAM_neg_din] \
  [get_bd_pins arbit_bramb0/BRAM_neg_addr] [get_bd_pins arbit_bramb0/BRAM_red_din] [get_bd_pins arbit_bramb0/BRAM_red_addr] \
  [get_bd_pins arbit_bramb0/BRAM_hash_din] [get_bd_pins arbit_bramb0/BRAM_hash_addr]
connect_bd_net -net Zero0_1 [get_bd_pins Zero0] \
  [get_bd_pins arbit_brama0/BRAM_sam_en] [get_bd_pins arbit_brama0/BRAM_sam_rst] [get_bd_pins arbit_brama0/BRAM_hash_rst] \
  [get_bd_pins arbit_brama0/sam_control] [get_bd_pins arbit_bramb0/BRAM_neg_en] [get_bd_pins arbit_bramb0/BRAM_neg_rst] \
  [get_bd_pins arbit_bramb0/BRAM_red_en] [get_bd_pins arbit_bramb0/BRAM_red_rst] [get_bd_pins arbit_bramb0/BRAM_hash_en] \
  [get_bd_pins arbit_bramb0/BRAM_hash_rst] [get_bd_pins arbit_bramb0/neg_control] [get_bd_pins arbit_bramb0/red_control] \
  [get_bd_pins arbit_bramb0/hash_control]
connect_bd_net -net add_control1_1 [get_bd_pins add_control1] [get_bd_pins arbit_bramb0/add_control]

current_bd_instance /TRNG
connect_bd_net [get_bd_pins mayo_trng_arbiter_0/o_trng_r] [get_bd_pins TRNG_0/R_I]
connect_bd_net [get_bd_pins mayo_trng_arbiter_0/o_trng_w] [get_bd_pins TRNG_0/W_I]
connect_bd_net [get_bd_pins mayo_trng_arbiter_0/o_trng_data] [get_bd_pins TRNG_0/TRNG_DATA_I]
connect_bd_net [get_bd_pins TRNG_0/TRNG_DATA_O] [get_bd_pins mayo_trng_arbiter_0/i_trng_data]
connect_bd_net [get_bd_pins TRNG_0/TRNG_VALID_O] [get_bd_pins mayo_trng_arbiter_0/i_trng_valid]
connect_bd_net [get_bd_pins TRNG_0/TRNG_DONE_O] [get_bd_pins mayo_trng_arbiter_0/i_trng_done]
connect_bd_net [get_bd_pins clk] [get_bd_pins TRNG_0/CLK_I]
connect_bd_net [get_bd_pins rst] [get_bd_pins TRNG_0/RST]
connect_bd_net [get_bd_pins mayo_trng_arbiter_0/o_trng0_data] [get_bd_pins o_trng0_data]
connect_bd_net [get_bd_pins mayo_trng_arbiter_0/o_trng0_valid] [get_bd_pins o_trng0_valid]
connect_bd_net [get_bd_pins mayo_trng_arbiter_0/o_trng0_done] [get_bd_pins o_trng0_done]
connect_bd_net [get_bd_pins i_trng0_r] [get_bd_pins mayo_trng_arbiter_0/i_trng0_r]
connect_bd_net [get_bd_pins i_trng0_w] [get_bd_pins mayo_trng_arbiter_0/i_trng0_w]
connect_bd_net [get_bd_pins i_trng0_data] [get_bd_pins mayo_trng_arbiter_0/i_trng0_data]
connect_bd_net [get_bd_pins mayo_trng_arbiter_0/o_trng1_data] [get_bd_pins o_trng1_data]
connect_bd_net [get_bd_pins mayo_trng_arbiter_0/o_trng1_valid] [get_bd_pins o_trng1_valid]
connect_bd_net [get_bd_pins mayo_trng_arbiter_0/o_trng1_done] [get_bd_pins o_trng1_done]
connect_bd_net [get_bd_pins i_trng_sel] [get_bd_pins mayo_trng_arbiter_0/i_trng_sel]
connect_bd_net [get_bd_pins i_trng1_r] [get_bd_pins mayo_trng_arbiter_0/i_trng1_r]
connect_bd_net [get_bd_pins i_trng1_w] [get_bd_pins mayo_trng_arbiter_0/i_trng1_w]
connect_bd_net -net i_trng1_data1_1 [get_bd_pins i_trng1_data1] [get_bd_pins mayo_trng_arbiter_0/i_trng1_data]

current_bd_instance /hash
connect_bd_net -net processing_system7_0_FCLK_CLK0 [get_bd_pins clk] [get_bd_pins MAYO_SHAKE_1/clk]
connect_bd_net -net rst_ps7_0_100M_peripheral_aresetn [get_bd_pins rst] [get_bd_pins MAYO_SHAKE_1/rst]
connect_bd_net [get_bd_pins mayo_hash_bram_arbit_0/hash_dout] [get_bd_pins MAYO_SHAKE_1/BRAMA_dout]
connect_bd_net [get_bd_pins BRAMA_dout] [get_bd_pins mayo_hash_bram_arbit_0/BRAM1_dout]
connect_bd_net [get_bd_pins mayo_hash_bram_arbit_0/BRAM1_we] [get_bd_pins BRAMA_we]
connect_bd_net [get_bd_pins mayo_hash_bram_arbit_0/BRAM1_en] [get_bd_pins BRAMA_en]
connect_bd_net [get_bd_pins mayo_hash_bram_arbit_0/BRAM1_addr] [get_bd_pins BRAMA_addr]
connect_bd_net [get_bd_pins mayo_hash_bram_arbit_0/BRAM1_din] [get_bd_pins BRAMA_din]
connect_bd_net [get_bd_pins mayo_hash_bram_arbit_0/BRAM0_din] [get_bd_pins BRAM0_din]
connect_bd_net [get_bd_pins mayo_hash_bram_arbit_0/BRAM0_addr] [get_bd_pins BRAM0_addr]
connect_bd_net [get_bd_pins mayo_hash_bram_arbit_0/BRAM0_en] [get_bd_pins BRAM0_en]
connect_bd_net [get_bd_pins mayo_hash_bram_arbit_0/BRAM0_we] [get_bd_pins BRAM0_we]
connect_bd_net [get_bd_pins BRAM0_dout] [get_bd_pins mayo_hash_bram_arbit_0/BRAM0_dout]
connect_bd_net [get_bd_pins mayo_hash_bram_arbit_0/BRAM1_control] [get_bd_pins BRAM1_control]
connect_bd_net [get_bd_pins mayo_hash_bram_arbit_0/BRAM0_control] [get_bd_pins BRAM0_control]
connect_bd_net [get_bd_pins bram_sel] [get_bd_pins mayo_hash_bram_arbit_0/bram_sel]
connect_bd_net [get_bd_pins i_key_en] [get_bd_pins MAYO_SHAKE_1/en]
connect_bd_net [get_bd_pins i_key_mlen] [get_bd_pins MAYO_SHAKE_1/mlen]
connect_bd_net [get_bd_pins i_key_olen] [get_bd_pins MAYO_SHAKE_1/olen]
connect_bd_net [get_bd_pins i_key_write_adr] [get_bd_pins MAYO_SHAKE_1/write_adr]
connect_bd_net [get_bd_pins i_key_read_adr] [get_bd_pins MAYO_SHAKE_1/read_adr]
connect_bd_net [get_bd_pins MAYO_SHAKE_1/dyn_done] [get_bd_pins o_key_dyn_done]
connect_bd_net [get_bd_pins MAYO_SHAKE_1/done] [get_bd_pins o_key_done]
connect_bd_net [get_bd_pins MAYO_SHAKE_1/o_control] [get_bd_pins mayo_hash_bram_arbit_0/hash_control]
connect_bd_net [get_bd_pins MAYO_SHAKE_1/BRAMA_we] [get_bd_pins mayo_hash_bram_arbit_0/hash_we]
connect_bd_net [get_bd_pins MAYO_SHAKE_1/BRAMA_addr] [get_bd_pins mayo_hash_bram_arbit_0/hash_addr]
connect_bd_net [get_bd_pins MAYO_SHAKE_1/BRAMA_din] [get_bd_pins mayo_hash_bram_arbit_0/hash_din]
connect_bd_net [get_bd_pins MAYO_SHAKE_1/BRAMA_en] [get_bd_pins mayo_hash_bram_arbit_0/hash_en]

current_bd_instance /
connect_bd_intf_net [get_bd_intf_pins ps7_0_axi_periph/M01_AXI] [get_bd_intf_pins mayo_axi_litev3_0/S00_AXI]
connect_bd_intf_net [get_bd_intf_pins ps7_0_axi_periph/M00_AXI] [get_bd_intf_pins BRAM_big1/S_AXI]
connect_bd_intf_net [get_bd_intf_pins processing_system7_0/M_AXI_GP0] [get_bd_intf_pins ps7_0_axi_periph/S00_AXI]
connect_bd_intf_net [get_bd_intf_ports FIXED_IO] [get_bd_intf_pins processing_system7_0/FIXED_IO]
connect_bd_intf_net [get_bd_intf_ports DDR] [get_bd_intf_pins processing_system7_0/DDR]
connect_bd_net [get_bd_pins processing_system7_0/FCLK_RESET0_N] [get_bd_pins rst_ps7_0_100M/ext_reset_in]
connect_bd_net -net BRAM0_dout_1 [get_bd_pins BRAM_small/BRAM_hash_dout] [get_bd_pins hash/BRAM0_dout]
connect_bd_net -net BRAM_big_BRAM_add_dout [get_bd_pins BRAM_big1/BRAM_add_dout] [get_bd_pins mayo_add_vectors_0/i_memc_dout]
connect_bd_net -net BRAM_big_BRAM_red_dout [get_bd_pins BRAM_big1/BRAM_red_dout] [get_bd_pins mayo_reduce_0/i_dout1]
connect_bd_net -net BRAM_key_addr1_1 [get_bd_pins MAYO_KEYGEN_FSM_0/o_mem0b_addr] [get_bd_pins BRAM_small/BRAM_key_addr1]
connect_bd_net -net BRAM_key_addr_1 [get_bd_pins MAYO_KEYGEN_FSM_0/o_mem1a_addr] [get_bd_pins BRAM_big1/BRAM_key_addr]
connect_bd_net -net BRAM_key_rst1_1 [get_bd_pins MAYO_KEYGEN_FSM_0/o_mem0b_rst] [get_bd_pins BRAM_small/BRAM_key_rst1]
connect_bd_net -net BRAM_key_rst_1 [get_bd_pins MAYO_KEYGEN_FSM_0/o_mem1a_rst] [get_bd_pins BRAM_big1/BRAM_key_rst]
connect_bd_net -net BRAM_key_we_1 [get_bd_pins MAYO_KEYGEN_FSM_0/o_mem0a_we] [get_bd_pins BRAM_small/BRAM_key_we]
connect_bd_net [get_bd_pins BRAM_small/BRAM_add_dout] [get_bd_pins mayo_add_vectors_0/i_mema_dout]
connect_bd_net [get_bd_pins BRAM_small/BRAM_add_dout1] [get_bd_pins mayo_add_vectors_0/i_memb_dout]
connect_bd_net -net Ground32_dout1 [get_bd_pins Ground33/dout] \
  [get_bd_pins BRAM_big1/BRAM_neg_din] [get_bd_pins BRAM_small/Zero_32] [get_bd_pins MAYO_KEYGEN_FSM_0/PUBLIC_KEY_ADDR_I] \
  [get_bd_pins MAYO_KEYGEN_FSM_0/SECRET_KEY_ADDR_I]
connect_bd_net -net Ground4_dout1 [get_bd_pins Ground5/dout] \
  [get_bd_pins BRAM_big1/BRAM_add_we] [get_bd_pins BRAM_small/Zero_4] [get_bd_pins xlconcat_0/In1]
connect_bd_net [get_bd_pins MAYO_KEYGEN_FSM_0/o_add_bram_sel] [get_bd_pins mayo_add_vectors_0/i_bram_sel]
connect_bd_net [get_bd_pins MAYO_KEYGEN_FSM_0/o_add_enable] [get_bd_pins mayo_add_vectors_0/i_enable]
connect_bd_net [get_bd_pins MAYO_KEYGEN_FSM_0/o_add_out_addr] [get_bd_pins mayo_add_vectors_0/i_out_addr]
connect_bd_net [get_bd_pins MAYO_KEYGEN_FSM_0/o_add_v1_addr] [get_bd_pins mayo_add_vectors_0/i_v1_addr]
connect_bd_net [get_bd_pins MAYO_KEYGEN_FSM_0/o_add_v2_addr] [get_bd_pins mayo_add_vectors_0/i_v2_addr]
connect_bd_net [get_bd_pins MAYO_KEYGEN_FSM_0/o_hash_en] [get_bd_pins hash/i_key_en]
connect_bd_net [get_bd_pins MAYO_KEYGEN_FSM_0/o_hash_memsel] [get_bd_pins hash/bram_sel]
connect_bd_net [get_bd_pins MAYO_KEYGEN_FSM_0/o_hash_mlen] [get_bd_pins hash/i_key_mlen]
connect_bd_net [get_bd_pins MAYO_KEYGEN_FSM_0/o_hash_olen] [get_bd_pins hash/i_key_olen]
connect_bd_net [get_bd_pins MAYO_KEYGEN_FSM_0/o_hash_read_adr] [get_bd_pins hash/i_key_read_adr]
connect_bd_net [get_bd_pins MAYO_KEYGEN_FSM_0/o_hash_write_adr] [get_bd_pins hash/i_key_write_adr]
connect_bd_net [get_bd_pins MAYO_KEYGEN_FSM_0/o_lin_bram_halt] [get_bd_pins mayo_linear_combinat_0/i_bram_halt]
connect_bd_net [get_bd_pins MAYO_KEYGEN_FSM_0/o_lin_coeffs_addr] [get_bd_pins mayo_linear_combinat_0/i_coeffs_addr]
connect_bd_net [get_bd_pins MAYO_KEYGEN_FSM_0/o_lin_enable] [get_bd_pins mayo_linear_combinat_0/i_enable]
connect_bd_net [get_bd_pins MAYO_KEYGEN_FSM_0/o_lin_len] [get_bd_pins mayo_linear_combinat_0/i_len]
connect_bd_net [get_bd_pins MAYO_KEYGEN_FSM_0/o_lin_out_addr] [get_bd_pins mayo_linear_combinat_0/i_out_addr]
connect_bd_net [get_bd_pins MAYO_KEYGEN_FSM_0/o_lin_vec_addr] [get_bd_pins mayo_linear_combinat_0/i_vec_addr]
connect_bd_net [get_bd_pins MAYO_KEYGEN_FSM_0/o_mem0a_addr] [get_bd_pins BRAM_small/BRAM_key_addr]
connect_bd_net [get_bd_pins MAYO_KEYGEN_FSM_0/o_mem0a_din] [get_bd_pins BRAM_small/BRAM_key_din]
connect_bd_net [get_bd_pins MAYO_KEYGEN_FSM_0/o_mem0a_en] [get_bd_pins BRAM_small/BRAM_key_en]
connect_bd_net [get_bd_pins MAYO_KEYGEN_FSM_0/o_mem0a_rst] [get_bd_pins BRAM_small/BRAM_key_rst]
connect_bd_net [get_bd_pins MAYO_KEYGEN_FSM_0/o_mem0b_control] [get_bd_pins BRAM_small/bram_control1]
connect_bd_net [get_bd_pins MAYO_KEYGEN_FSM_0/o_mem0b_din] [get_bd_pins BRAM_small/BRAM_key_din1]
connect_bd_net [get_bd_pins MAYO_KEYGEN_FSM_0/o_mem0b_en] [get_bd_pins BRAM_small/BRAM_key_en1]
connect_bd_net [get_bd_pins MAYO_KEYGEN_FSM_0/o_mem0b_we] [get_bd_pins BRAM_small/BRAM_key_we1]
connect_bd_net [get_bd_pins MAYO_KEYGEN_FSM_0/o_mem1a_din] [get_bd_pins BRAM_big1/BRAM_key_din]
connect_bd_net [get_bd_pins MAYO_KEYGEN_FSM_0/o_mem1a_en] [get_bd_pins BRAM_big1/BRAM_key_en]
connect_bd_net [get_bd_pins MAYO_KEYGEN_FSM_0/o_mem1a_we] [get_bd_pins BRAM_big1/BRAM_key_we]
connect_bd_net [get_bd_pins MAYO_KEYGEN_FSM_0/o_neg_adr] [get_bd_pins mayo_negate_0/i_adr]
connect_bd_net [get_bd_pins MAYO_KEYGEN_FSM_0/o_neg_enable] [get_bd_pins mayo_negate_0/i_enable]
connect_bd_net [get_bd_pins MAYO_KEYGEN_FSM_0/o_neg_len] [get_bd_pins mayo_negate_0/i_len]
connect_bd_net [get_bd_pins MAYO_KEYGEN_FSM_0/o_red_adr] [get_bd_pins mayo_reduce_0/i_adr]
connect_bd_net [get_bd_pins MAYO_KEYGEN_FSM_0/o_red_bram_sel] [get_bd_pins mayo_reduce_0/i_bram_sel]
connect_bd_net [get_bd_pins MAYO_KEYGEN_FSM_0/o_red_enable] [get_bd_pins mayo_reduce_0/i_enable]
connect_bd_net [get_bd_pins MAYO_KEYGEN_FSM_0/o_red_len] [get_bd_pins mayo_reduce_0/i_len]
connect_bd_net [get_bd_pins MAYO_KEYGEN_FSM_0/o_sam_enable] [get_bd_pins mayo_sample_oil_space_0/i_enable]
connect_bd_net [get_bd_pins MAYO_KEYGEN_FSM_0/o_sam_oil_addr] [get_bd_pins mayo_sample_oil_space_0/i_oil_addr]
connect_bd_net [get_bd_pins MAYO_KEYGEN_FSM_0/o_trng_data] [get_bd_pins TRNG/i_trng0_data]
connect_bd_net [get_bd_pins MAYO_KEYGEN_FSM_0/o_trng_r] [get_bd_pins TRNG/i_trng0_r]
connect_bd_net [get_bd_pins MAYO_KEYGEN_FSM_0/o_trng_w] [get_bd_pins TRNG/i_trng0_w]
connect_bd_net -net MAYO_SHAKE_1_BRAMA_addr [get_bd_pins hash/BRAMA_addr] [get_bd_pins BRAM_big1/BRAM_hash_addr]
connect_bd_net -net MAYO_SHAKE_1_BRAMA_din [get_bd_pins hash/BRAMA_din] [get_bd_pins BRAM_big1/BRAM_hash_din]
connect_bd_net -net MAYO_SHAKE_1_BRAMA_en [get_bd_pins hash/BRAMA_en] [get_bd_pins BRAM_big1/BRAM_hash_en]
connect_bd_net -net MAYO_SHAKE_1_BRAMA_we [get_bd_pins hash/BRAMA_we] [get_bd_pins BRAM_big1/BRAM_hash_we]
connect_bd_net [get_bd_pins TRNG/o_trng0_data] [get_bd_pins MAYO_KEYGEN_FSM_0/i_trng_data]
connect_bd_net [get_bd_pins TRNG/o_trng0_done] [get_bd_pins MAYO_KEYGEN_FSM_0/i_trng_done]
connect_bd_net [get_bd_pins TRNG/o_trng0_valid] [get_bd_pins MAYO_KEYGEN_FSM_0/i_trng_valid]
connect_bd_net [get_bd_pins TRNG/o_trng1_data] [get_bd_pins mayo_sample_oil_space_0/i_trng_data]
connect_bd_net [get_bd_pins TRNG/o_trng1_done] [get_bd_pins mayo_sample_oil_space_0/i_trng_done]
connect_bd_net [get_bd_pins TRNG/o_trng1_valid] [get_bd_pins mayo_sample_oil_space_0/i_trng_valid]
connect_bd_net -net add_control_1 [get_bd_pins mayo_add_vectors_0/o_controlc] [get_bd_pins BRAM_big1/add_control]
connect_bd_net -net arbit_brama0_BRAM_key_dout [get_bd_pins BRAM_small/BRAM_key_dout] [get_bd_pins MAYO_KEYGEN_FSM_0/i_mem0a_dout]
connect_bd_net -net arbit_brama0_BRAM_lin_dout [get_bd_pins BRAM_small/BRAM_lin_dout] [get_bd_pins mayo_linear_combinat_0/i_mem0a_dout]
connect_bd_net -net arbit_brama0_BRAM_neg_dout [get_bd_pins BRAM_small/BRAM_neg_dout] [get_bd_pins mayo_negate_0/i_doutb]
connect_bd_net -net arbit_brama0_BRAM_red_dout [get_bd_pins BRAM_small/BRAM_red_dout] [get_bd_pins mayo_reduce_0/i_dout0]
connect_bd_net -net arbit_brama1_BRAM_hash_dout [get_bd_pins BRAM_big1/BRAM_hash_dout] [get_bd_pins hash/BRAMA_dout]
connect_bd_net -net arbit_brama1_BRAM_key_dout1 [get_bd_pins BRAM_big1/BRAM_key_dout] [get_bd_pins MAYO_KEYGEN_FSM_0/i_mem1a_dout]
connect_bd_net -net arbit_brama1_BRAM_lin_dout [get_bd_pins BRAM_big1/BRAM_lin_dout] [get_bd_pins mayo_linear_combinat_0/i_mem1a_dout]
connect_bd_net -net arbit_bramb0_BRAM_key_dout [get_bd_pins BRAM_small/BRAM_key_dout1] [get_bd_pins MAYO_KEYGEN_FSM_0/i_mem0b_dout]
connect_bd_net -net arbit_bramb0_BRAM_sam_dout [get_bd_pins BRAM_small/BRAM_sam_dout1] [get_bd_pins mayo_sample_oil_space_0/i_memb_dout]
connect_bd_net -net bram_control_1 [get_bd_pins MAYO_KEYGEN_FSM_0/o_mem1a_control] [get_bd_pins BRAM_big1/bram_control]
connect_bd_net -net bram_control_2 [get_bd_pins MAYO_KEYGEN_FSM_0/o_mem0a_control] [get_bd_pins BRAM_small/bram_control]
connect_bd_net [get_bd_pins hash/BRAM0_addr] [get_bd_pins BRAM_small/BRAM_hash_addr]
connect_bd_net [get_bd_pins hash/BRAM0_control] [get_bd_pins BRAM_small/hash_control]
connect_bd_net [get_bd_pins hash/BRAM0_din] [get_bd_pins BRAM_small/BRAM_hash_din]
connect_bd_net [get_bd_pins hash/BRAM0_en] [get_bd_pins BRAM_small/BRAM_hash_en]
connect_bd_net [get_bd_pins hash/BRAM0_we] [get_bd_pins BRAM_small/BRAM_hash_we1]
connect_bd_net -net hash_control_1 [get_bd_pins hash/BRAM1_control] [get_bd_pins BRAM_big1/hash_control]
connect_bd_net [get_bd_pins mayo_add_vectors_0/o_controla] [get_bd_pins BRAM_small/add_control]
connect_bd_net [get_bd_pins mayo_add_vectors_0/o_controlb] [get_bd_pins BRAM_small/add_control1]
connect_bd_net [get_bd_pins mayo_add_vectors_0/o_done] [get_bd_pins MAYO_KEYGEN_FSM_0/i_add_done]
connect_bd_net [get_bd_pins mayo_add_vectors_0/o_mema_addr] [get_bd_pins BRAM_small/BRAM_add_addr]
connect_bd_net [get_bd_pins mayo_add_vectors_0/o_mema_din] [get_bd_pins BRAM_small/BRAM_add_din]
connect_bd_net [get_bd_pins mayo_add_vectors_0/o_mema_en] [get_bd_pins BRAM_small/BRAM_add_en]
connect_bd_net [get_bd_pins mayo_add_vectors_0/o_mema_rst] [get_bd_pins BRAM_small/BRAM_add_rst]
connect_bd_net [get_bd_pins mayo_add_vectors_0/o_mema_we] [get_bd_pins BRAM_small/BRAM_add_we]
connect_bd_net [get_bd_pins mayo_add_vectors_0/o_memb_addr] [get_bd_pins BRAM_small/BRAM_add_addr1]
connect_bd_net [get_bd_pins mayo_add_vectors_0/o_memb_din] [get_bd_pins BRAM_small/BRAM_add_din1]
connect_bd_net [get_bd_pins mayo_add_vectors_0/o_memb_en] [get_bd_pins BRAM_small/BRAM_add_en1]
connect_bd_net [get_bd_pins mayo_add_vectors_0/o_memb_rst] [get_bd_pins BRAM_small/BRAM_add_rst1]
connect_bd_net [get_bd_pins mayo_add_vectors_0/o_memb_we] [get_bd_pins BRAM_small/BRAM_add_we1]
connect_bd_net [get_bd_pins mayo_add_vectors_0/o_memc_addr] [get_bd_pins BRAM_big1/BRAM_add_addr]
connect_bd_net [get_bd_pins mayo_add_vectors_0/o_memc_din] [get_bd_pins BRAM_big1/BRAM_add_din]
connect_bd_net [get_bd_pins mayo_add_vectors_0/o_memc_en] [get_bd_pins BRAM_big1/BRAM_add_en]
connect_bd_net [get_bd_pins mayo_add_vectors_0/o_memc_rst] [get_bd_pins BRAM_big1/BRAM_add_rst1]
connect_bd_net [get_bd_pins mayo_add_vectors_0/o_memc_we] [get_bd_pins BRAM_big1/BRAM_add_we1]
connect_bd_net -net mayo_bram_arbiter_1_BRAM_lin_dout [get_bd_pins BRAM_small/BRAM_lin_dout1] [get_bd_pins mayo_linear_combinat_0/i_mem0b_dout]
connect_bd_net -net mayo_hash_arbiter_0_o_key_done [get_bd_pins hash/o_key_done] [get_bd_pins MAYO_KEYGEN_FSM_0/i_hash_done]
connect_bd_net -net mayo_hash_arbiter_0_o_key_dyn_done [get_bd_pins hash/o_key_dyn_done] [get_bd_pins MAYO_KEYGEN_FSM_0/i_hash_dyn_done]
connect_bd_net [get_bd_pins mayo_linear_combinat_0/o_control0a] [get_bd_pins BRAM_small/lin_control]
connect_bd_net [get_bd_pins mayo_linear_combinat_0/o_control0b] [get_bd_pins BRAM_small/lin_control1]
connect_bd_net [get_bd_pins mayo_linear_combinat_0/o_control1a] [get_bd_pins BRAM_big1/lin_control]
connect_bd_net [get_bd_pins mayo_linear_combinat_0/o_done] [get_bd_pins MAYO_KEYGEN_FSM_0/i_lin_done]
connect_bd_net [get_bd_pins mayo_linear_combinat_0/o_mem0a_addr] [get_bd_pins BRAM_small/BRAM_lin_addr]
connect_bd_net [get_bd_pins mayo_linear_combinat_0/o_mem0a_din] [get_bd_pins BRAM_small/BRAM_lin_din]
connect_bd_net [get_bd_pins mayo_linear_combinat_0/o_mem0a_en] [get_bd_pins BRAM_small/BRAM_lin_en]
connect_bd_net [get_bd_pins mayo_linear_combinat_0/o_mem0a_rst] [get_bd_pins BRAM_small/BRAM_lin_rst]
connect_bd_net [get_bd_pins mayo_linear_combinat_0/o_mem0a_we] [get_bd_pins BRAM_small/BRAM_lin_we]
connect_bd_net [get_bd_pins mayo_linear_combinat_0/o_mem0b_addr] [get_bd_pins BRAM_small/BRAM_lin_addr1]
connect_bd_net [get_bd_pins mayo_linear_combinat_0/o_mem0b_din] [get_bd_pins BRAM_small/BRAM_lin_din1]
connect_bd_net [get_bd_pins mayo_linear_combinat_0/o_mem0b_en] [get_bd_pins BRAM_small/BRAM_lin_en1]
connect_bd_net [get_bd_pins mayo_linear_combinat_0/o_mem0b_rst] [get_bd_pins BRAM_small/BRAM_lin_rst1]
connect_bd_net [get_bd_pins mayo_linear_combinat_0/o_mem0b_we] [get_bd_pins BRAM_small/BRAM_lin_we1]
connect_bd_net [get_bd_pins mayo_linear_combinat_0/o_mem1a_addr] [get_bd_pins BRAM_big1/BRAM_lin_addr]
connect_bd_net [get_bd_pins mayo_linear_combinat_0/o_mem1a_din] [get_bd_pins BRAM_big1/BRAM_lin_din]
connect_bd_net [get_bd_pins mayo_linear_combinat_0/o_mem1a_en] [get_bd_pins BRAM_big1/BRAM_lin_en]
connect_bd_net [get_bd_pins mayo_linear_combinat_0/o_mem1a_rst] [get_bd_pins BRAM_big1/BRAM_lin_rst]
connect_bd_net [get_bd_pins mayo_linear_combinat_0/o_mem1a_we] [get_bd_pins BRAM_big1/BRAM_lin_we]
connect_bd_net [get_bd_pins mayo_negate_0/o_addrb] [get_bd_pins BRAM_small/BRAM_neg_addr]
connect_bd_net [get_bd_pins mayo_negate_0/o_control] [get_bd_pins BRAM_small/neg_control]
connect_bd_net [get_bd_pins mayo_negate_0/o_dinb] [get_bd_pins BRAM_small/BRAM_neg_din]
connect_bd_net [get_bd_pins mayo_negate_0/o_done] [get_bd_pins MAYO_KEYGEN_FSM_0/i_neg_done]
connect_bd_net [get_bd_pins mayo_negate_0/o_enb] [get_bd_pins BRAM_small/BRAM_neg_en]
connect_bd_net [get_bd_pins mayo_negate_0/o_rstb] [get_bd_pins BRAM_small/BRAM_neg_rst]
connect_bd_net [get_bd_pins mayo_negate_0/o_web] [get_bd_pins BRAM_small/BRAM_neg_we]
connect_bd_net [get_bd_pins mayo_reduce_0/o_addr1] [get_bd_pins BRAM_big1/BRAM_red_addr]
connect_bd_net -net mayo_reduce_0_o_addrb [get_bd_pins mayo_reduce_0/o_addr0] [get_bd_pins BRAM_small/BRAM_red_addr]
connect_bd_net [get_bd_pins mayo_reduce_0/o_control0] [get_bd_pins BRAM_small/red_control]
connect_bd_net [get_bd_pins mayo_reduce_0/o_control1] [get_bd_pins BRAM_big1/red_control]
connect_bd_net [get_bd_pins mayo_reduce_0/o_din0] [get_bd_pins BRAM_small/BRAM_red_din]
connect_bd_net [get_bd_pins mayo_reduce_0/o_din1] [get_bd_pins BRAM_big1/BRAM_red_din]
connect_bd_net [get_bd_pins mayo_reduce_0/o_done] [get_bd_pins MAYO_KEYGEN_FSM_0/i_red_done]
connect_bd_net [get_bd_pins mayo_reduce_0/o_en1] [get_bd_pins BRAM_big1/BRAM_red_en]
connect_bd_net -net mayo_reduce_0_o_enb [get_bd_pins mayo_reduce_0/o_en0] [get_bd_pins BRAM_small/BRAM_red_en]
connect_bd_net [get_bd_pins mayo_reduce_0/o_rst1] [get_bd_pins BRAM_big1/BRAM_red_rst]
connect_bd_net -net mayo_reduce_0_o_rstb [get_bd_pins mayo_reduce_0/o_rst0] [get_bd_pins BRAM_small/BRAM_red_rst]
connect_bd_net [get_bd_pins mayo_reduce_0/o_we1] [get_bd_pins BRAM_big1/BRAM_red_we]
connect_bd_net -net mayo_reduce_0_o_web [get_bd_pins mayo_reduce_0/o_we0] [get_bd_pins BRAM_small/BRAM_red_we]
connect_bd_net [get_bd_pins mayo_sample_oil_space_0/o_controlb] [get_bd_pins BRAM_small/sam_control1]
connect_bd_net [get_bd_pins mayo_sample_oil_space_0/o_done] [get_bd_pins MAYO_KEYGEN_FSM_0/i_sam_done]
connect_bd_net [get_bd_pins mayo_sample_oil_space_0/o_memb_addr] [get_bd_pins BRAM_small/BRAM_sam_addr1]
connect_bd_net [get_bd_pins mayo_sample_oil_space_0/o_memb_din] [get_bd_pins BRAM_small/BRAM_sam_din1]
connect_bd_net [get_bd_pins mayo_sample_oil_space_0/o_memb_en] [get_bd_pins BRAM_small/BRAM_sam_en1]
connect_bd_net [get_bd_pins mayo_sample_oil_space_0/o_memb_rst] [get_bd_pins BRAM_small/BRAM_sam_rst1]
connect_bd_net [get_bd_pins mayo_sample_oil_space_0/o_memb_we] [get_bd_pins BRAM_small/BRAM_sam_we1]
connect_bd_net [get_bd_pins mayo_sample_oil_space_0/o_trng_data] [get_bd_pins TRNG/i_trng1_data1]
connect_bd_net [get_bd_pins mayo_sample_oil_space_0/o_trng_r] [get_bd_pins TRNG/i_trng1_r]
connect_bd_net [get_bd_pins mayo_sample_oil_space_0/o_trng_sel] [get_bd_pins TRNG/i_trng_sel]
connect_bd_net [get_bd_pins mayo_sample_oil_space_0/o_trng_w] [get_bd_pins TRNG/i_trng1_w]
connect_bd_net [get_bd_pins MAYO_KEYGEN_FSM_0/o_err] [get_bd_pins xlconcat_0/In0]
connect_bd_net [get_bd_pins mayo_axi_litev3_0/o_Debug] [get_bd_pins MAYO_KEYGEN_FSM_0/i_debug]
connect_bd_net [get_bd_pins mayo_axi_litev3_0/o_Expose] [get_bd_pins MAYO_KEYGEN_FSM_0/i_expose]
connect_bd_net [get_bd_pins mayo_axi_litev3_0/o_Keygen_en] [get_bd_pins MAYO_KEYGEN_FSM_0/ENABLE]
connect_bd_net [get_bd_pins xlconcat_0/dout] [get_bd_pins mayo_axi_litev3_0/i_error]
connect_bd_net [get_bd_pins mayo_axi_litev3_0/o_interrupt] [get_bd_pins processing_system7_0/IRQ_F2P]
connect_bd_net [get_bd_pins rst_ps7_0_100M/peripheral_reset] \
  [get_bd_pins hash/rst] [get_bd_pins TRNG/rst] [get_bd_pins blink_led_0/rst] [get_bd_pins MAYO_KEYGEN_FSM_0/RESET] \
  [get_bd_pins mayo_negate_0/rst] [get_bd_pins mayo_reduce_0/rst] [get_bd_pins mayo_sample_oil_space_0/rst] \
  [get_bd_pins mayo_linear_combinat_0/rst] [get_bd_pins mayo_add_vectors_0/rst]
